# EAGLE design Qwiic_Keyboard_Explorer (EAGLE 9.6.2)
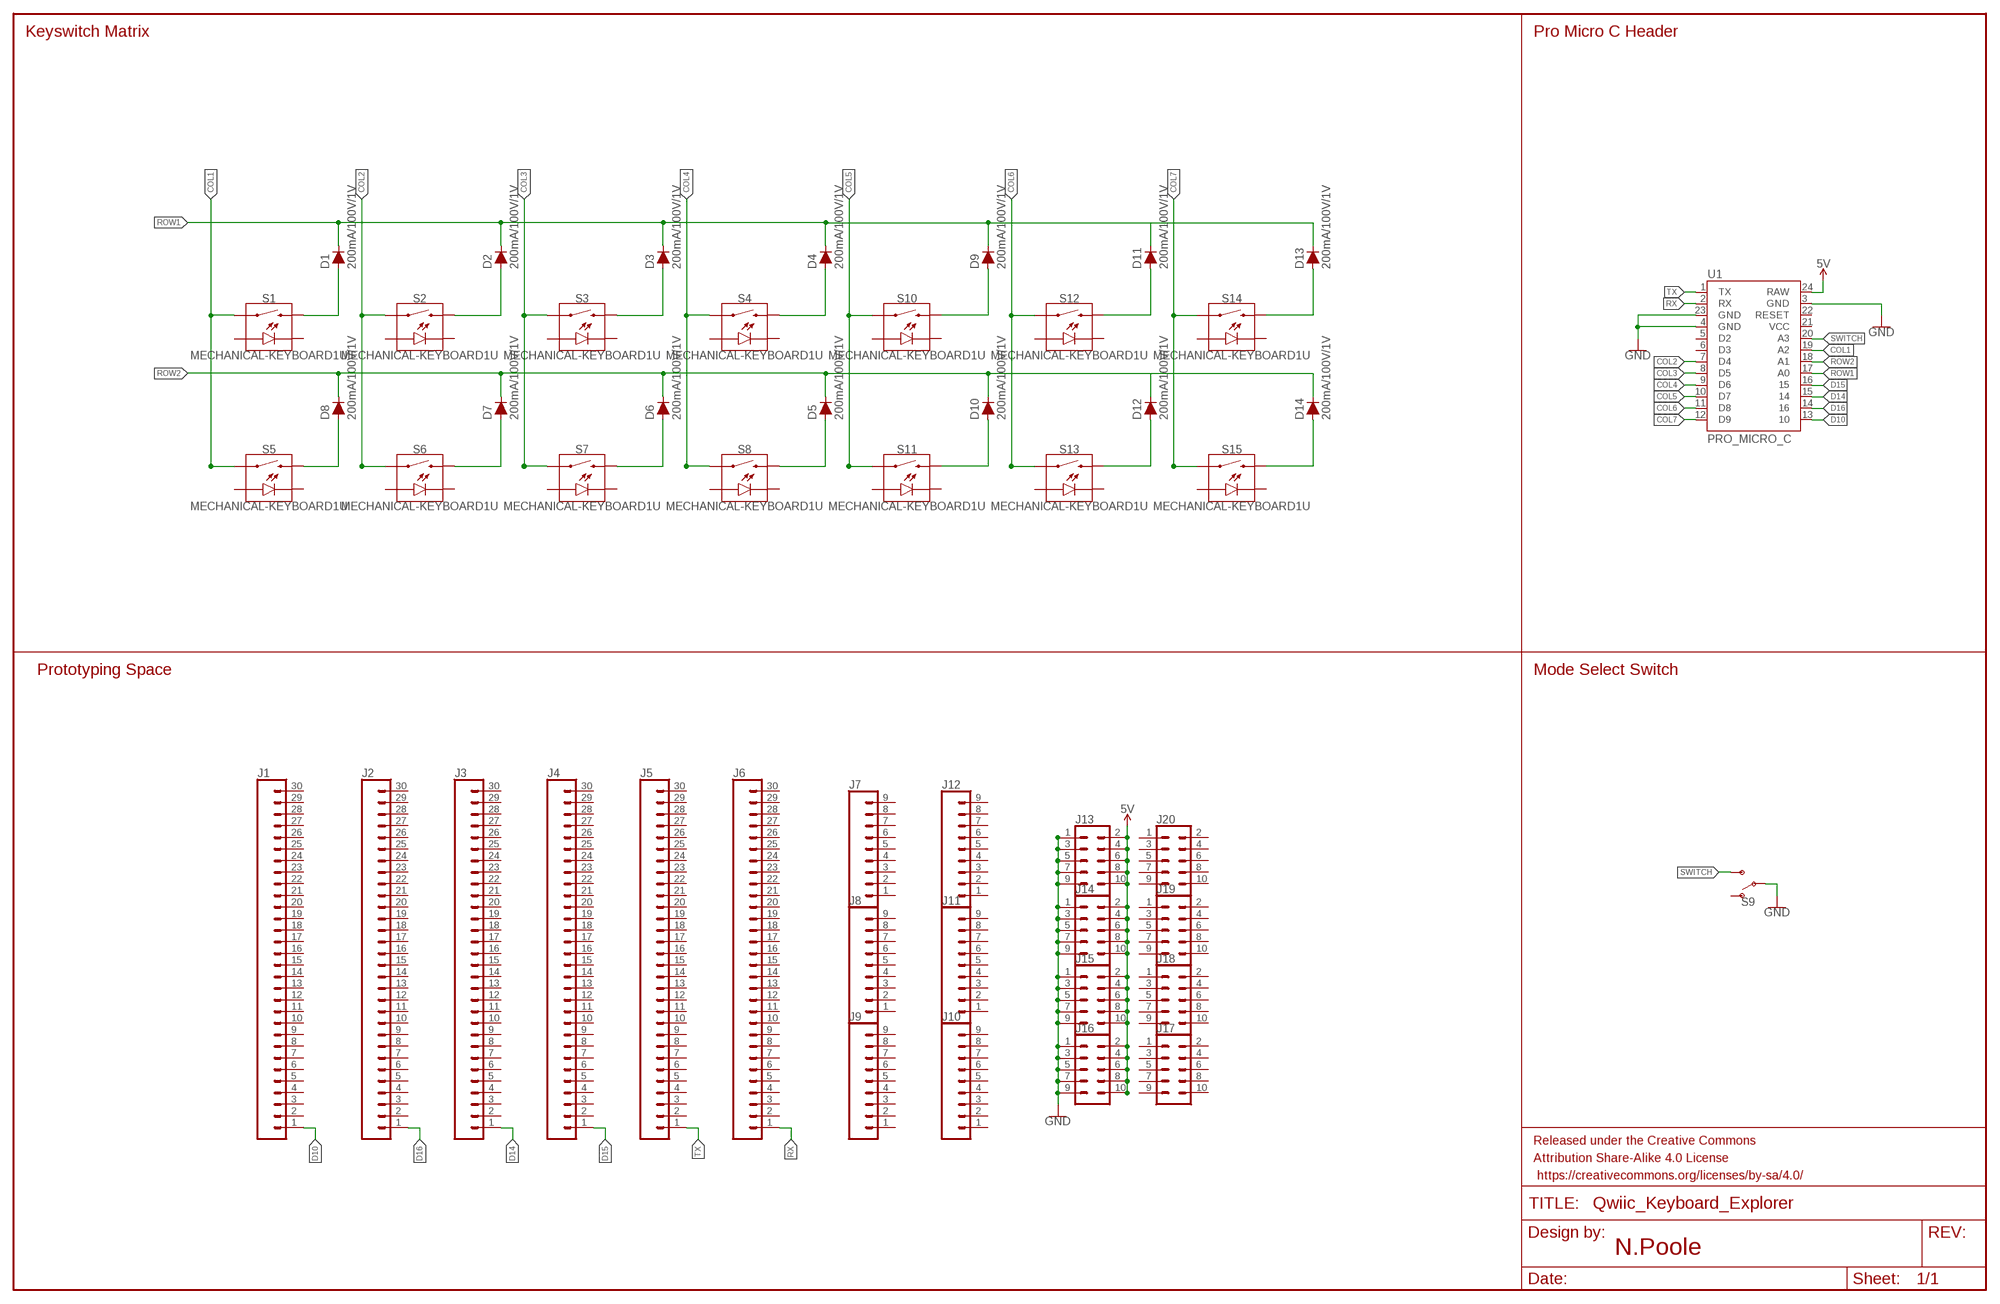
[diagram p0: schematic, sheet 1]

## Parts
D1  200mA/100V/1V  DIODE-KIT  [DIODE-1N4148-KIT]
D2  200mA/100V/1V  DIODE-KIT  [DIODE-1N4148-KIT]
D3  200mA/100V/1V  DIODE-KIT  [DIODE-1N4148-KIT]
D4  200mA/100V/1V  DIODE-KIT  [DIODE-1N4148-KIT]
D5  200mA/100V/1V  DIODE-KIT  [DIODE-1N4148-KIT]
D6  200mA/100V/1V  DIODE-KIT  [DIODE-1N4148-KIT]
D7  200mA/100V/1V  DIODE-KIT  [DIODE-1N4148-KIT]
D8  200mA/100V/1V  DIODE-KIT  [DIODE-1N4148-KIT]
D9  200mA/100V/1V  DIODE-KIT  [DIODE-1N4148-KIT]
D10  200mA/100V/1V  DIODE-KIT  [DIODE-1N4148-KIT]
D11  200mA/100V/1V  DIODE-KIT  [DIODE-1N4148-KIT]
D12  200mA/100V/1V  DIODE-KIT  [DIODE-1N4148-KIT]
D13  200mA/100V/1V  DIODE-KIT  [DIODE-1N4148-KIT]
D14  200mA/100V/1V  DIODE-KIT  [DIODE-1N4148-KIT]
FRAME1  FRAME-LEDGER  [CREATIVE_COMMONS]
J1  CONN_30NO_SILK  [1X30_NO_SILK]
J2  CONN_30NO_SILK  [1X30_NO_SILK]
J3  CONN_30NO_SILK  [1X30_NO_SILK]
J4  CONN_30NO_SILK  [1X30_NO_SILK]
J5  CONN_30NO_SILK  [1X30_NO_SILK]
J6  CONN_30NO_SILK  [1X30_NO_SILK]
J7  CONN_09NO_SILK  [1X09_NO_SILK]
J8  CONN_09NO_SILK  [1X09_NO_SILK]
J9  CONN_09NO_SILK  [1X09_NO_SILK]
J10  CONN_09NO_SILK  [1X09_NO_SILK]
J11  CONN_09NO_SILK  [1X09_NO_SILK]
J12  CONN_09NO_SILK  [1X09_NO_SILK]
J13  CONN_05X2NO_SILK  [2X5_NOSILK]
J14  CONN_05X2NO_SILK  [2X5_NOSILK]
J15  CONN_05X2NO_SILK  [2X5_NOSILK]
J16  CONN_05X2NO_SILK  [2X5_NOSILK]
J17  CONN_05X2NO_SILK  [2X5_NOSILK]
J18  CONN_05X2NO_SILK  [2X5_NOSILK]
J19  CONN_05X2NO_SILK  [2X5_NOSILK]
J20  CONN_05X2NO_SILK  [2X5_NOSILK]
S1  MECHANICAL-KEYBOARD1U  [CHERRY-MX-LED-1U]
S2  MECHANICAL-KEYBOARD1U  [CHERRY-MX-LED-1U]
S3  MECHANICAL-KEYBOARD1U  [CHERRY-MX-LED-1U]
S4  MECHANICAL-KEYBOARD1U  [CHERRY-MX-LED-1U]
S5  MECHANICAL-KEYBOARD1U  [CHERRY-MX-LED-1U]
S6  MECHANICAL-KEYBOARD1U  [CHERRY-MX-LED-1U]
S7  MECHANICAL-KEYBOARD1U  [CHERRY-MX-LED-1U]
S8  MECHANICAL-KEYBOARD1U  [CHERRY-MX-LED-1U]
S9  SWITCH-SPDT-PTH-11.6X4.0MM-KIT  [SWITCH_SPDT_PTH_11.6X4.0MM_KIT]
S10  MECHANICAL-KEYBOARD1U  [CHERRY-MX-LED-1U]
S11  MECHANICAL-KEYBOARD1U  [CHERRY-MX-LED-1U]
S12  MECHANICAL-KEYBOARD1U  [CHERRY-MX-LED-1U]
S13  MECHANICAL-KEYBOARD1U  [CHERRY-MX-LED-1U]
S14  MECHANICAL-KEYBOARD1U  [CHERRY-MX-LED-1U]
S15  MECHANICAL-KEYBOARD1U  [CHERRY-MX-LED-1U]
U1  PRO_MICRO_C  [PRO_MICRO_C]

## Nets
5V: J13.2 J13.4 J13.6 J13.8 J13.10 J14.2 J14.4 J14.6 J14.8 J14.10 J15.2 J15.4 J15.6 J15.8 J15.10 J16.2 J16.4 J16.6 J16.8 J16.10 U1.24(RAW)
COL1: S1.S1 S5.S1 U1.19(A2)
COL2: S2.S1 S6.S1 U1.7(D4)
COL3: S3.S1 S7.S1 U1.8(D5)
COL4: S4.S1 S8.S1 U1.9(D6)
COL5: S10.S1 S11.S1 U1.10(D7)
COL6: S12.S1 S13.S1 U1.11(D8)
COL7: S14.S1 S15.S1 U1.12(D9)
D10: J1.1 U1.13
D14: J3.1 U1.15
D15: J4.1 U1.16
D16: J2.1 U1.14
GND: J13.1 J13.3 J13.5 J13.7 J13.9 J14.1 J14.3 J14.5 J14.7 J14.9 J15.1 J15.3 J15.5 J15.7 J15.9 J16.1 J16.3 J16.5 J16.7 J16.9 S9.2(P) U1.3(GND) U1.4(GND) U1.23(GND)
N$7: D8.A S5.S2
N$8: D7.A S6.S2
N$9: D6.A S7.S2
N$10: D5.A S8.S2
N$11: D4.A S4.S2
N$12: D3.A S3.S2
N$13: D2.A S2.S2
N$14: D1.A S1.S2
N$15: D9.A S10.S2
N$16: D10.A S11.S2
N$19: D11.A S12.S2
N$20: D12.A S13.S2
N$23: D13.A S14.S2
N$24: D14.A S15.S2
ROW1: D1.C D2.C D3.C D4.C D9.C D11.C D13.C U1.17(A0)
ROW2: D5.C D6.C D7.C D8.C D10.C D12.C D14.C U1.18(A1)
RX: J6.1 U1.2(RX)
SWITCH: S9.3(S) U1.20(A3)
TX: J5.1 U1.1(TX)
Unconnected: J1.2 J1.3 J1.4 J1.5 J1.6 J1.7 J1.8 J1.9 J1.10 J1.11 J1.12 J1.13 J1.14 J1.15 J1.16 J1.17 J1.18 J1.19 J1.20 J1.21 J1.22 J1.23 J1.24 J1.25 J1.26 J1.27 J1.28 J1.29 J1.30 J2.2 J2.3 J2.4 J2.5 J2.6 J2.7 J2.8 J2.9 J2.10 J2.11 J2.12 J2.13 J2.14 J2.15 J2.16 J2.17 J2.18 J2.19 J2.20 J2.21 J2.22 J2.23 J2.24 J2.25 J2.26 J2.27 J2.28 J2.29 J2.30 J3.2 J3.3 J3.4 J3.5 J3.6 J3.7 J3.8 J3.9 J3.10 J3.11 J3.12 J3.13 J3.14 J3.15 J3.16 J3.17 J3.18 J3.19 J3.20 J3.21 J3.22 J3.23 J3.24 J3.25 J3.26 J3.27 J3.28 J3.29 J3.30 J4.2 J4.3 J4.4 J4.5 J4.6 J4.7 J4.8 J4.9 J4.10 J4.11 J4.12 J4.13 J4.14 J4.15 J4.16 J4.17 J4.18 J4.19 J4.20 J4.21 J4.22 J4.23 J4.24 J4.25 J4.26 J4.27 J4.28 J4.29 J4.30 J5.2 J5.3 J5.4 J5.5 J5.6 J5.7 J5.8 J5.9 J5.10 J5.11 J5.12 J5.13 J5.14 J5.15 J5.16 J5.17 J5.18 J5.19 J5.20 J5.21 J5.22 J5.23 J5.24 J5.25 J5.26 J5.27 J5.28 J5.29 J5.30 J6.2 J6.3 J6.4 J6.5 J6.6 J6.7 J6.8 J6.9 J6.10 J6.11 J6.12 J6.13 J6.14 J6.15 J6.16 J6.17 J6.18 J6.19 J6.20 J6.21 J6.22 J6.23 J6.24 J6.25 J6.26 J6.27 J6.28 J6.29 J6.30 J7.1 J7.2 J7.3 J7.4 J7.5 J7.6 J7.7 J7.8 J7.9 J8.1 J8.2 J8.3 J8.4 J8.5 J8.6 J8.7 J8.8 J8.9 J9.1 J9.2 J9.3 J9.4 J9.5 J9.6 J9.7 J9.8 J9.9 J10.1 J10.2 J10.3 J10.4 J10.5 J10.6 J10.7 J10.8 J10.9 J11.1 J11.2 J11.3 J11.4 J11.5 J11.6 J11.7 J11.8 J11.9 J12.1 J12.2 J12.3 J12.4 J12.5 J12.6 J12.7 J12.8 J12.9 J17.1 J17.2 J17.3 J17.4 J17.5 J17.6 J17.7 J17.8 J17.9 J17.10 J18.1 J18.2 J18.3 J18.4 J18.5 J18.6 J18.7 J18.8 J18.9 J18.10 J19.1 J19.2 J19.3 J19.4 J19.5 J19.6 J19.7 J19.8 J19.9 J19.10 J20.1 J20.2 J20.3 J20.4 J20.5 J20.6 J20.7 J20.8 J20.9 J20.10 S1.A S1.K(C) S2.A S2.K(C) S3.A S3.K(C) S4.A S4.K(C) S5.A S5.K(C) S6.A S6.K(C) S7.A S7.K(C) S8.A S8.K(C) S9.1(O) S10.A S10.K(C) S11.A S11.K(C) S12.A S12.K(C) S13.A S13.K(C) S14.A S14.K(C) S15.A S15.K(C) U1.5(D2) U1.6(D3) U1.21(VCC) U1.22(RESET)

## Notes on the sheet
- Keyswitch Matrix | Pro Micro C Header
- Prototyping Space | Mode Select Switch
- N.Poole

## Library data of the parts
D1-D14 = SparkFun-DiscreteSemi:DIODE: Diode These are standard reverse protection diodes and small signal diodes. SparkFun Products: SparkFun SparkPunk Sound Kit <https://www.sparkfun.com/products/11177> SparkFun ESP8266 Thing <https://www.sparkfun.com/products/13231>; PROD_ID: DIO-08378
FRAME1 = SparkFun-Aesthetics:FRAME-LEDGER: Schematic Frame - Ledger Standard 11x14 US Ledger frame
J1-J6 = SparkFun-Connectors:CONN_30: Multi connection point. Often used as Generic Header-pin footprint for 0.1 inch spaced/style header connections On any of the 0.1 inch spaced packages, you can populate with these: Break Away Headers - Straight <https://www.sparkfun.com/products/116> (PRT-00116) Break Away Male Headers - Right Angle <https://www.sparkfun.com/products/553> (PRT-00553) Female Headers <https://www.sparkfun.com/products/115> (PRT-00115) Break Away Headers - Machine Pin <https://www.sparkfun.com/products/117> (PRT-00117) Break Away Female Headers - Swiss Machine Pin <https://www.sparkfun.com/products/743> (PRT-00743) For SCREWTERMINALS and SPRING TERMINALS visit here: Screw Terimnals on SparkFun.com <https://www.sparkfun.com/search/results?term=Screw+Terminals> (5mm/3.5mm/2.54mm spacing) This device is also useful as a general connection point to wire up your design to another part of your project. Our various solder wires solder well into these plated through hole pads. Hook-Up Wire - Assortment (Stranded, 22 AWG) <https://www.sparkfun.com/products/11375> (PRT-11375) Hook-Up Wire - Assortment (Solid Core, 22 AWG) <https://www.sparkfun.com/products/11367> (PRT-11367) View the entire wire category on our website here <https://www.sparkfun.com/categories/141> Special notes: Molex polarized connector foot print use with SKU : PRT-08231 with associated crimp pins and housings. 1MM SMD Version SKU: PRT-10208 NOTES ON THE VARIANTS LOCK and LOCK_LONGPADS... This footprint was designed to help hold the alignment of a through-hole component (i.e. 6-pin header) while soldering it into place. You may notice that each hole has been shifted either up or down by 0.005 of an inch from it's more standard position (which is a perfectly straight line). This slight alteration caused the pins (the squares in the middle) to touch the edges of the holes. Because they are alternating, it causes a "brace" to hold the component in place. 0.005 has proven to be the perfect amount of "off-center" position when using our standard breakaway headers. Although looks a little odd when you look at the bare footprint, once you have a header in there, the alteration is very hard to notice. Also,if you push a header all the way into place, it is covered up entirely on the bottom side.
J7-J12 = SparkFun-Connectors:CONN_09: Multi connection point. Often used as Generic Header-pin footprint for 0.1 inch spaced/style header connections On any of the 0.1 inch spaced packages, you can populate with these: Break Away Headers - Straight <https://www.sparkfun.com/products/116> (PRT-00116) Break Away Male Headers - Right Angle <https://www.sparkfun.com/products/553> (PRT-00553) Female Headers <https://www.sparkfun.com/products/115> (PRT-00115) Break Away Headers - Machine Pin <https://www.sparkfun.com/products/117> (PRT-00117) Break Away Female Headers - Swiss Machine Pin <https://www.sparkfun.com/products/743> (PRT-00743) For SCREWTERMINALS and SPRING TERMINALS visit here: Screw Terimnals on SparkFun.com <https://www.sparkfun.com/search/results?term=Screw+Terminals> (5mm/3.5mm/2.54mm spacing) This device is also useful as a general connection point to wire up your design to another part of your project. Our various solder wires solder well into these plated through hole pads. Hook-Up Wire - Assortment (Stranded, 22 AWG) <https://www.sparkfun.com/products/11375> (PRT-11375) Hook-Up Wire - Assortment (Solid Core, 22 AWG) <https://www.sparkfun.com/products/11367> (PRT-11367) View the entire wire category on our website here <https://www.sparkfun.com/categories/141> Special notes: Molex polarized connector foot print use with SKU : PRT-08231 with associated crimp pins and housings. 1MM SMD Version SKU: PRT-10208 NOTES ON THE VARIANTS LOCK and LOCK_LONGPADS... This footprint was designed to help hold the alignment of a through-hole component (i.e. 6-pin header) while soldering it into place. You may notice that each hole has been shifted either up or down by 0.005 of an inch from it's more standard position (which is a perfectly straight line). This slight alteration caused the pins (the squares in the middle) to touch the edges of the holes. Because they are alternating, it causes a "brace" to hold the component in place. 0.005 has proven to be the perfect amount of "off-center" position when using our standard breakaway headers. Although looks a little odd when you look at the bare footprint, once you have a header in there, the alteration is very hard to notice. Also,if you push a header all the way into place, it is covered up entirely on the bottom side.
J13-J20 = SparkFun-Connectors:CONN_05X2: Multi connection point. Often used as Generic Header-pin footprint for 0.1 inch spaced/style header connections For AVR SPI programming port, see special device with nice symbol: "AVR_SPI_PROG_5x2.dev" You can populate with any combo of single row headers, but if you'd like an exact match, check these: 2x5 AVR ICSP Male Header <https://www.sparkfun.com/products/778> (PRT-00778) 2x5 Pin Shrouded Header <https://www.sparkfun.com/products/8506> (PRT-08506) On any of the 0.1 inch spaced packages, you can populate with these: Break Away Headers - Straight <https://www.sparkfun.com/products/116> (PRT-00116) Break Away Male Headers - Right Angle <https://www.sparkfun.com/products/553> (PRT-00553) Female Headers <https://www.sparkfun.com/products/115> (PRT-00115) Break Away Headers - Machine Pin <https://www.sparkfun.com/products/117> (PRT-00117) Break Away Female Headers - Swiss Machine Pin <https://www.sparkfun.com/products/743> (PRT-00743) Special note: the shrouded connector mates well with our 5x2 ribbon cables: 2x5 Pin IDC Ribbon Cable <https://www.sparkfun.com/products/8535> (PRT-08535)
S1-S8 S10-S15 = SparkFun-Switches:MECHANICAL-KEYBOARD: Mechanical Keyboard Spacings for Cherry-MX Cherry-MX w/ LED switch footprints. Each package variant contains a bounding box on the tDocu layer for proper key spacing and a dimensional drawing on the Reference layer to be exported for laser cut mounting plates. Footprints are off-center so that the origin lies on the lower left corner of the key-spacing. This allows for most common layouts to be easily acheived on a grid spacing of 0.1875" Variants 1U through 1.75U in .25U steps Centered switch cutout in SwitchPlate layer with no stabilizers 2U through 2.75U in .25U steps Centered switch cutout in SwitchPlate layer with Cherry+Costar stabilizer holes 6.25U Common spacebar size Centered switch cutout in SwitchPlate layer with Cherry+Costar stabilizer holes "Big Ass" Enter ANSI 104 "Big Ass" Enter Key layout ISO Enter ISO style Enter Key layout
S9 = SparkFun-Switches:SWITCH-SPDT: Single Pole, Double Throw (SPDT) Switch Single-pole, double-throw (SPDT) switch. Variant Overview SMD-AYZ0202 Surface Mount DPDT Switch <https://www.sparkfun.com/products/597> (COM-00597) Used on e.g. LilyPad Arduino USB - ATmega32U4 Board <https://www.sparkfun.com/products/12049> PTH-11.6X4.0MM SPDT Mini Power Switch <https://www.sparkfun.com/products/102> (COM-00102) Used on e.g. SparkFun Simon Says - Through-Hole Soldering Kit <https://www.sparkfun.com/products/10547> (KIT-10547) PTH-11.6X4.0MM-KIT KIT version of SPDT Mini Power Switch - Simplifies soldering by removing tStop of switch pins - only one side can be soldered. PTH-11.6X4.0MM-LOCK LOCK version of SPDT Mini Power Switch - Offset pins hold switch in place for easier soldering. SMD-RIGHT-ANGLE Surface Mount Right Angle Switch <https://www.sparkfun.com/products/10860> (COM-10860) Used on e.g. SparkFun ESP8266 Thing <https://www.sparkfun.com/products/13231>; PROD_ID: SWCH-08261; SF_SKU: COM-00102
U1 = SparkFun-Boards:PRO_MICRO_C

## Board
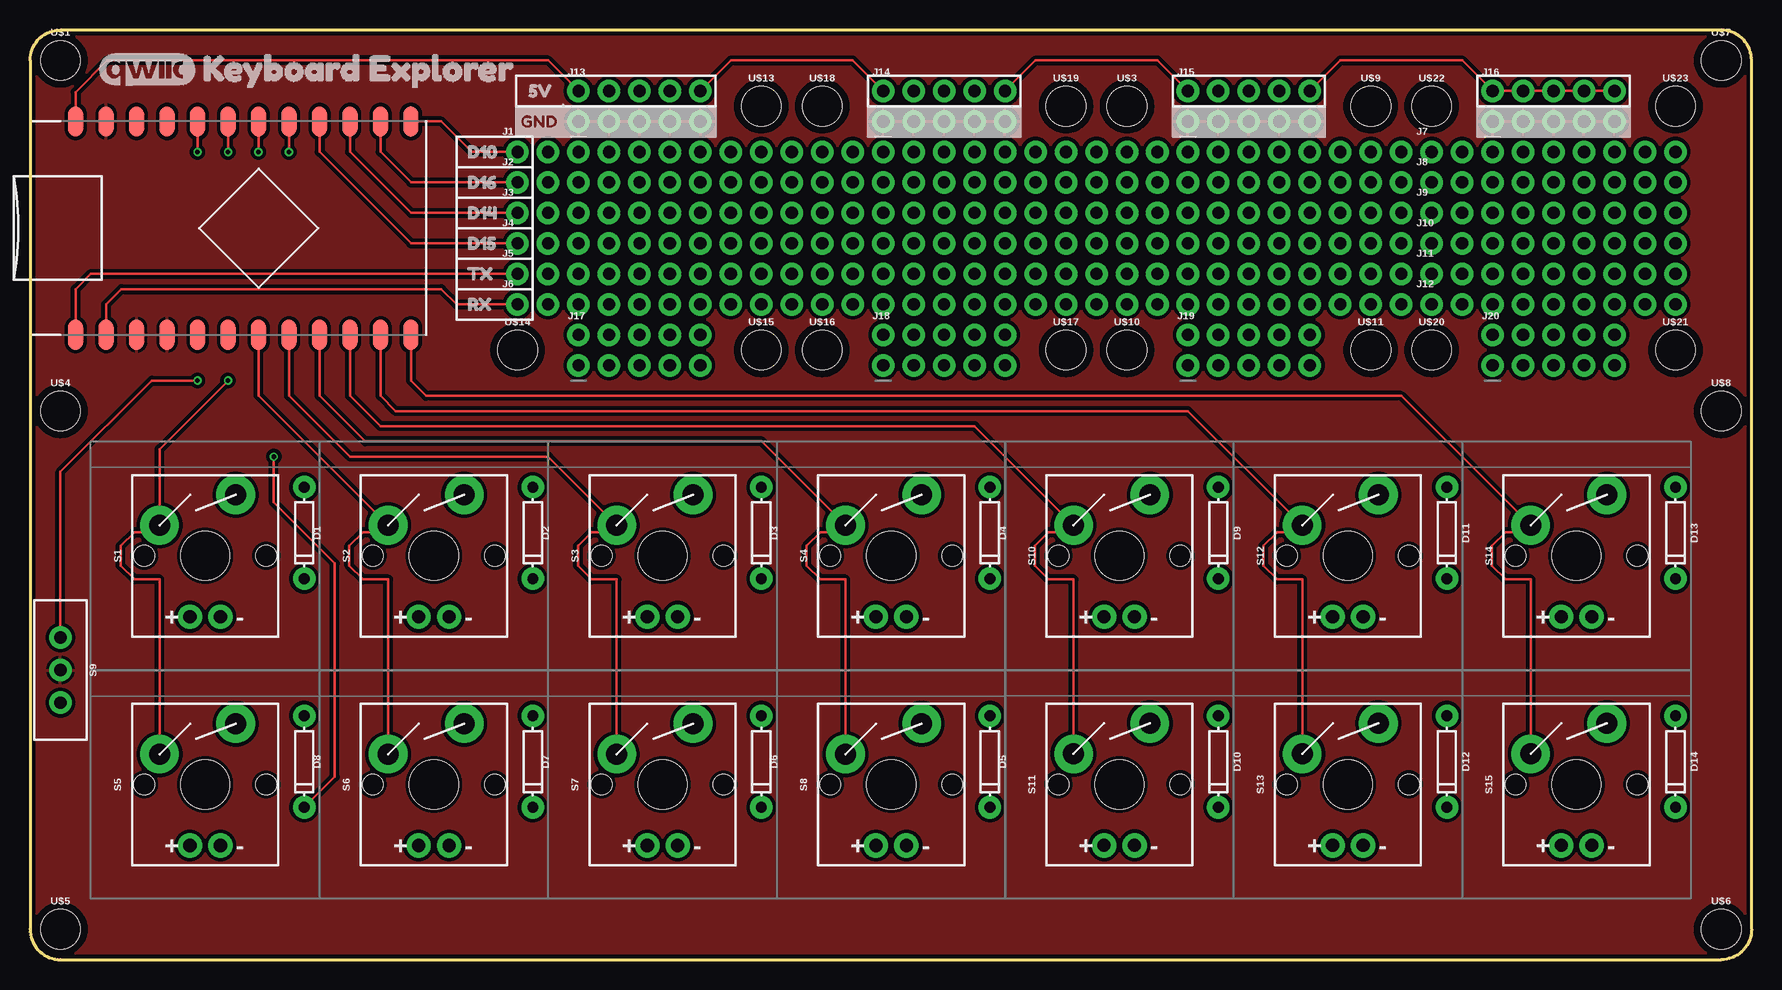
[diagram p1: board, top side]
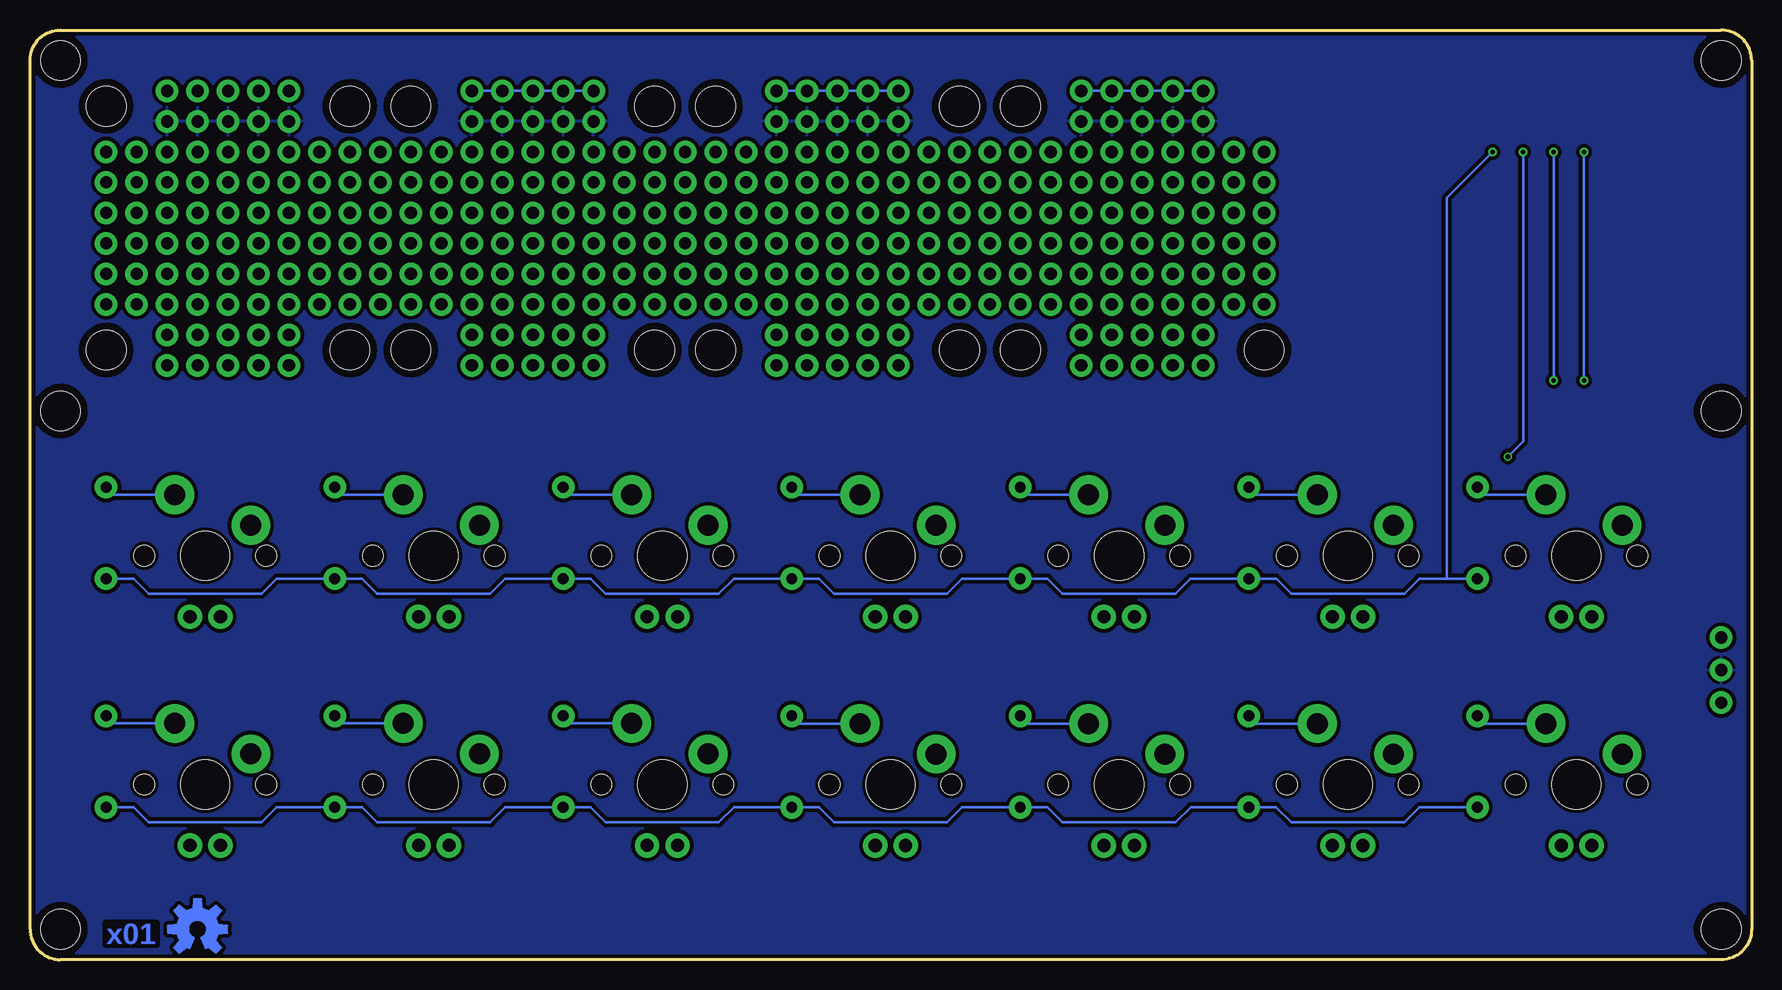
[diagram p2: board, bottom side, seen from below]

Size 143.51 x 77.47 mm. Coordinates in mm from the lower left corner, seen from the top.
Outline: 2.54,0 140.97,0 arc90 143.51,2.54 143.51,74.93 arc90 140.97,77.47 2.54,77.47 arc90 0,74.93 0,2.54 arc90 2.54,0
Copper layers (1*16): Top 0.035mm / dielectric 1.5mm / Bottom 0.035mm
Design rules "SparkFun-2-layer-PCBWay-LIMIT": minimum track width 6mil, minimum drill 0.3mm, track to track 6mil, track to pad 6mil, pad to pad 6mil, via to via 6mil, smd to smd 6mil, copper to edge 6mil, drill to drill 6mil, minimum pad ring 6mil, minimum via ring 6mil, stop-mask expansion 4mil, vias tented up to drill 25mil, thermal gap 10mil

### Footprints (pad centres in the part's own frame; a part is rotated, then mirrored left to right if it is on the bottom)
DIODE-1N4148-KIT = drill 0.9 pad 1.88: A -3.81,0; C 3.81,0
1X30_NO_SILK = drill 1.016 pad 1.88: 1 0,0; 2 2.54,0; 3 5.08,0; 4 7.62,0; 5 10.16,0; 6 12.7,0; 7 15.24,0; 8 17.78,0; 9 20.32,0; 10 22.86,0; 11 25.4,0; 12 27.94,0; 13 30.48,0; 14 33.02,0; 15 35.56,0; 16 38.1,0; 17 40.64,0; 18 43.18,0; 19 45.72,0; 20 48.26,0; 21 50.8,0; 22 53.34,0; 23 55.88,0; 24 58.42,0; 25 60.96,0; 26 63.5,0; 27 66.04,0; 28 68.58,0; 29 71.12,0; 30 73.66,0
1X09_NO_SILK = drill 1.016 pad 1.88: 1 0,0; 2 2.54,0; 3 5.08,0; 4 7.62,0; 5 10.16,0; 6 12.7,0; 7 15.24,0; 8 17.78,0; 9 20.32,0
2X5_NOSILK = drill 1.016 pad 1.88: 1 0,0; 2 0,2.54; 3 2.54,0; 4 2.54,2.54; 5 5.08,0; 6 5.08,2.54; 7 7.62,0; 8 7.62,2.54; 9 10.16,0; 10 10.16,2.54
CHERRY-MX-LED-1U = drill 1.092 pad 2.032: A 8.255,4.445; K 10.795,4.445 | drill 1.753 pad 3.226: S1 5.715,12.065; S2 12.065,14.605 | hole 4.089: 9.525,9.525 | hole 1.707: 4.445,9.525; 14.605,9.525
SWITCH_SPDT_PTH_11.6X4.0MM_KIT = drill 1.016 pad 1.88: 1 0,2.718; 2 0,0; 3 0,-2.718
PRO_MICRO_C = smd 2.54 x 1.27: 1 -8.89,12.7; 2 -8.89,10.16; 3 -8.89,7.62; 4 -8.89,5.08; 5 -8.89,2.54; 6 -8.89,0; 7 -8.89,-2.54; 8 -8.89,-5.08; 9 -8.89,-7.62; 10 -8.89,-10.16; 11 -8.89,-12.7; 12 -8.89,-15.24; 13 8.89,-15.24; 14 8.89,-12.7; 15 8.89,-10.16; 16 8.89,-7.62; 17 8.89,-5.08; 18 8.89,-2.54; 19 8.89,0; 20 8.89,2.54; 21 8.89,5.08; 22 8.89,7.62; 23 8.89,10.16; 24 8.89,12.7
STAND-OFF = hole 3.302: 0,0

### Placement (x,y rotation side)
D1  22.86,35.56 270 top
D2  41.91,35.56 270 top
D3  60.96,35.56 270 top
D4  80.01,35.56 270 top
D5  80.01,16.51 270 top
D6  60.96,16.51 270 top
D7  41.91,16.51 270 top
D8  22.86,16.51 270 top
D9  99.06,35.56 270 top
D10  99.06,16.51 270 top
D11  118.11,35.56 270 top
D12  118.11,16.51 270 top
D13  137.16,35.56 270 top
D14  137.16,16.51 270 top
FRAME1  20.32,-8.89 0 top  (outside the outline)
J1  40.64,67.31 0 top
J2  40.64,64.77 0 top
J3  40.64,62.23 0 top
J4  40.64,59.69 0 top
J5  40.64,57.15 0 top
J6  40.64,54.61 0 top
J7  116.84,67.31 0 top
J8  116.84,64.77 0 top
J9  116.84,62.23 0 top
J10  116.84,59.69 0 top
J11  116.84,57.15 0 top
J12  116.84,54.61 0 top
J13  45.72,69.85 0 top
J14  71.12,69.85 0 top
J15  96.52,69.85 0 top
J16  121.92,69.85 0 top
J17  45.72,49.53 0 top
J18  71.12,49.53 0 top
J19  96.52,49.53 0 top
J20  121.92,49.53 0 top
S1  5.08,24.13 0 top
S2  24.14,24.13 0 top
S3  43.2,24.13 0 top
S4  62.26,24.13 0 top
S5  5.08,5.07 0 top
S6  24.14,5.07 0 top
S7  43.2,5.07 0 top
S8  62.26,5.07 0 top
S9  2.54,24.13 180 top
S10  81.28,24.13 0 top
S11  81.28,5.08 0 top
S12  100.33,24.13 0 top
S13  100.33,5.08 0 top
S14  119.38,24.13 0 top
S15  119.38,5.08 0 top
U1  16.51,60.96 90 top
U$1  [STAND-OFF]  2.54,74.93 0 top
U$2  [KEYBOARD_EXPLORER0]  12.57,74.3 0 top
U$3  [STAND-OFF]  91.44,71.12 0 top
U$4  [STAND-OFF]  2.54,45.72 0 top
U$5  [STAND-OFF]  2.54,2.54 0 top
U$6  [STAND-OFF]  140.97,2.54 0 top
U$7  [STAND-OFF]  140.97,74.93 0 top
U$8  [STAND-OFF]  140.97,45.72 0 top
U$9  [STAND-OFF]  111.76,71.12 0 top
U$10  [STAND-OFF]  91.44,50.8 0 top
U$11  [STAND-OFF]  111.76,50.8 0 top
U$12  [5V0]  40.64,72.39 0 top
U$13  [STAND-OFF]  60.96,71.12 0 top
U$14  [STAND-OFF]  40.64,50.8 0 top
U$15  [STAND-OFF]  60.96,50.8 0 top
U$16  [STAND-OFF]  66.04,50.8 0 top
U$17  [STAND-OFF]  86.36,50.8 0 top
U$18  [STAND-OFF]  66.04,71.12 0 top
U$19  [STAND-OFF]  86.36,71.12 0 top
U$20  [STAND-OFF]  116.84,50.8 0 top
U$21  [STAND-OFF]  137.16,50.8 0 top
U$22  [STAND-OFF]  116.84,71.12 0 top
U$23  [STAND-OFF]  137.16,71.12 0 top
U$24  [QWIIC_8MM]  9.78,74.17 0 top
U$25  [GND-04]  40.01,69.85 0 top
U$26  [D101]  35.56,67.31 0 top
U$27  [D162]  35.56,64.77 0 top
U$28  [D143]  35.56,62.23 0 top
U$29  [D154]  35.56,59.69 0 top
U$30  [TX5]  35.56,57.15 0 top
U$31  [RX6]  35.56,54.61 0 top
U$32  [OSHW-LOGO-M_COPPER]  129.54,2.54 0 bottom

### Tracks (layer width: path | path; a pad name or v marks a point on that pad's centre or on a via)
5V
  Top 0.203: J16.10 J16.8 J16.6 J16.4 J16.2 119.38,74.93 109.22,74.93 J15.10 | J13.2 43.18,74.93 6.46,74.93 3.81,72.28 U1.24 | J13.10 58.42,74.93 68.58,74.93 J14.2 | J14.10 83.82,74.93 93.98,74.93 J15.2
  Bottom 0.203: J13.2 J13.4 J13.6 J13.8 J13.10 | J14.2 J14.4 J14.6 J14.8 J14.10 | J15.2 J15.4 J15.6 J15.8 J15.10
COL1  (via drill 0.38)
  Top 0.203: S5.S1 10.79,31.68 8.71,31.68 7.55,32.84 7.55,34.47 8.71,35.63 10.79,35.63 S1.S1 10.79,42.55 v16.51,48.26 | v16.51,67.31 U1.19
  Bottom 0.203: v16.51,48.26 v16.51,67.31
COL2
  Top 0.203: S6.S1 29.86,31.68 27.77,31.68 26.61,32.84 26.61,34.47 27.77,35.63 29.86,35.63 S2.S1 19.05,47 U1.7
COL3
  Top 0.203: S7.S1 48.91,31.68 46.83,31.68 45.67,32.84 45.67,34.47 46.83,35.63 48.91,35.63 S3.S1 43.2,41.91 26.67,41.91 21.59,46.99 U1.8
COL4
  Top 0.203: S8.S1 67.97,31.68 65.89,31.68 64.73,32.84 64.73,34.47 65.89,35.63 67.97,35.63 S4.S1 60.99,43.18 27.94,43.18 24.13,46.99 U1.9
COL5
  Top 0.203: S11.S1 87,31.68 84.91,31.68 83.75,32.84 83.75,34.47 84.91,35.63 87,35.63 S10.S1 78.74,44.45 29.21,44.45 26.67,46.99 U1.10
COL6
  Top 0.203: S13.S1 106.05,31.68 103.96,31.68 102.8,32.84 102.8,34.47 103.96,35.63 106.05,35.63 S12.S1 96.52,45.72 30.48,45.72 29.21,46.99 U1.11
COL7
  Top 0.203: S15.S1 125.09,31.68 123.01,31.68 121.85,32.84 121.85,34.47 123.01,35.63 125.09,35.63 S14.S1 114.3,46.99 33.02,46.99 31.75,48.26 U1.12
D10
  Top 0.203: J1.1 36.83,67.31 34.29,69.85 U1.13
D14
  Top 0.203: U1.15 26.67,67.31 31.75,62.23 J3.1
D15
  Top 0.203: U1.16 24.13,67.31 31.75,59.69 J4.1
D16
  Top 0.203: U1.14 29.21,67.31 31.75,64.77 J2.1
GND
  pour Top (isolate 0.305): 0,0 0,77.47 143.51,77.47 143.51,0
  pour Bottom (isolate 0.305): 0,77.47 0,0 143.51,0 143.51,77.47
N$7
  Bottom 0.203: D8.A 22.86,19.68 S5.S2
N$8
  Bottom 0.203: D7.A 41.91,19.68 S6.S2
N$9
  Bottom 0.203: D6.A 60.96,19.68 S7.S2
N$10
  Bottom 0.203: D5.A 80.01,19.68 S8.S2
N$11
  Bottom 0.203: D4.A 80.01,38.73 S4.S2
N$12
  Bottom 0.203: D3.A 60.96,38.73 S3.S2
N$13
  Bottom 0.203: D2.A 41.91,38.73 S2.S2
N$14
  Bottom 0.203: D1.A 22.86,38.73 S1.S2
N$15
  Bottom 0.203: D9.A 99.06,38.73 S10.S2
N$16
  Bottom 0.203: D10.A 99.06,19.68 S11.S2
N$19
  Bottom 0.203: D11.A 118.11,38.73 S12.S2
N$20
  Bottom 0.203: D12.A 118.11,19.68 S13.S2
N$23
  Bottom 0.203: D13.A 137.16,38.73 S14.S2
N$24
  Bottom 0.203: D14.A 137.16,19.68 S15.S2
ROW1  (via drill 0.38)
  Top 0.203: U1.17 v21.59,67.31
  Bottom 0.203: D1.C 25.4,31.75 | 25.4,31.75 27.7,31.75 28.96,30.49 38.37,30.49 39.63,31.75 D2.C 46.76,31.75 48.02,30.49 57.43,30.49 58.69,31.75 D3.C 65.82,31.75 67.08,30.49 76.49,30.49 77.75,31.75 D4.C 84.84,31.75 86.1,30.49 95.51,30.49 96.77,31.75 D9.C 103.89,31.75 105.15,30.49 114.56,30.49 115.82,31.75 D11.C 122.94,31.75 124.2,30.49 133.61,30.49 134.87,31.75 D13.C | 25.4,31.75 25.4,63.5 v21.59,67.31
ROW2  (via drill 0.38)
  Top 0.203: D8.C 25.4,15.24 25.4,33.02 20.32,38.1 v20.32,41.91 | v19.05,67.31 U1.18
  Bottom 0.203: D8.C 27.69,12.7 28.96,11.43 38.37,11.43 39.64,12.7 D7.C 46.75,12.7 48.02,11.43 57.43,11.43 58.7,12.7 D6.C 65.81,12.7 67.08,11.43 76.49,11.43 77.76,12.7 D5.C 84.84,12.7 86.1,11.44 95.51,11.44 96.77,12.7 D10.C 103.89,12.7 105.15,11.44 114.56,11.44 115.82,12.7 D12.C 122.94,12.7 124.2,11.44 133.61,11.44 134.87,12.7 D14.C | v20.32,41.91 19.05,43.18 v19.05,67.31
RX
  Top 0.203: U1.2 6.35,54.61 7.62,55.88 34.29,55.88 35.56,54.61 J6.1
SWITCH  (via drill 0.38)
  Top 0.203: S9.3 2.54,40.64 10.16,48.26 v13.97,48.26 | v13.97,67.31 U1.20
  Bottom 0.203: v13.97,48.26 v13.97,67.31
TX
  Top 0.203: U1.1 3.81,55.88 5.08,57.15 J5.1

### Text on the board
Bottom: x01
tDocu: N.Poole